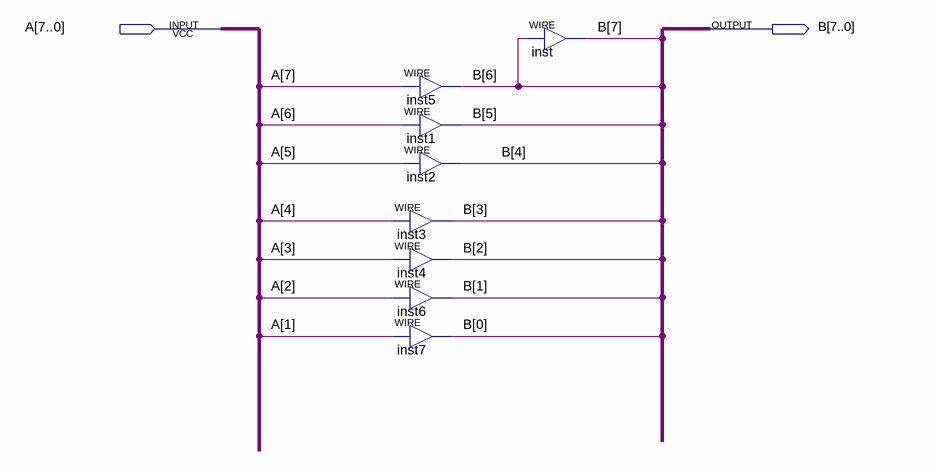
[diagram p0: schematic sheet]
// Quartus schematic RightShift.bdf as structural Verilog: 8 symbols, 2 pins
module RightShift (
  input  [7:0] A,
  output [7:0] B
);

  assign B[6] = A[7];  // WIRE inst5
  assign B[5] = A[6];  // WIRE inst1
  assign B[4] = A[5];  // WIRE inst2
  assign B[3] = A[4];  // WIRE inst3
  assign B[2] = A[3];  // WIRE inst4
  assign B[1] = A[2];  // WIRE inst6
  assign B[0] = A[1];  // WIRE inst7
  assign B[7] = B[6];  // WIRE inst
endmodule
